# EAGLE design USB Client DP (EAGLE 5.04)
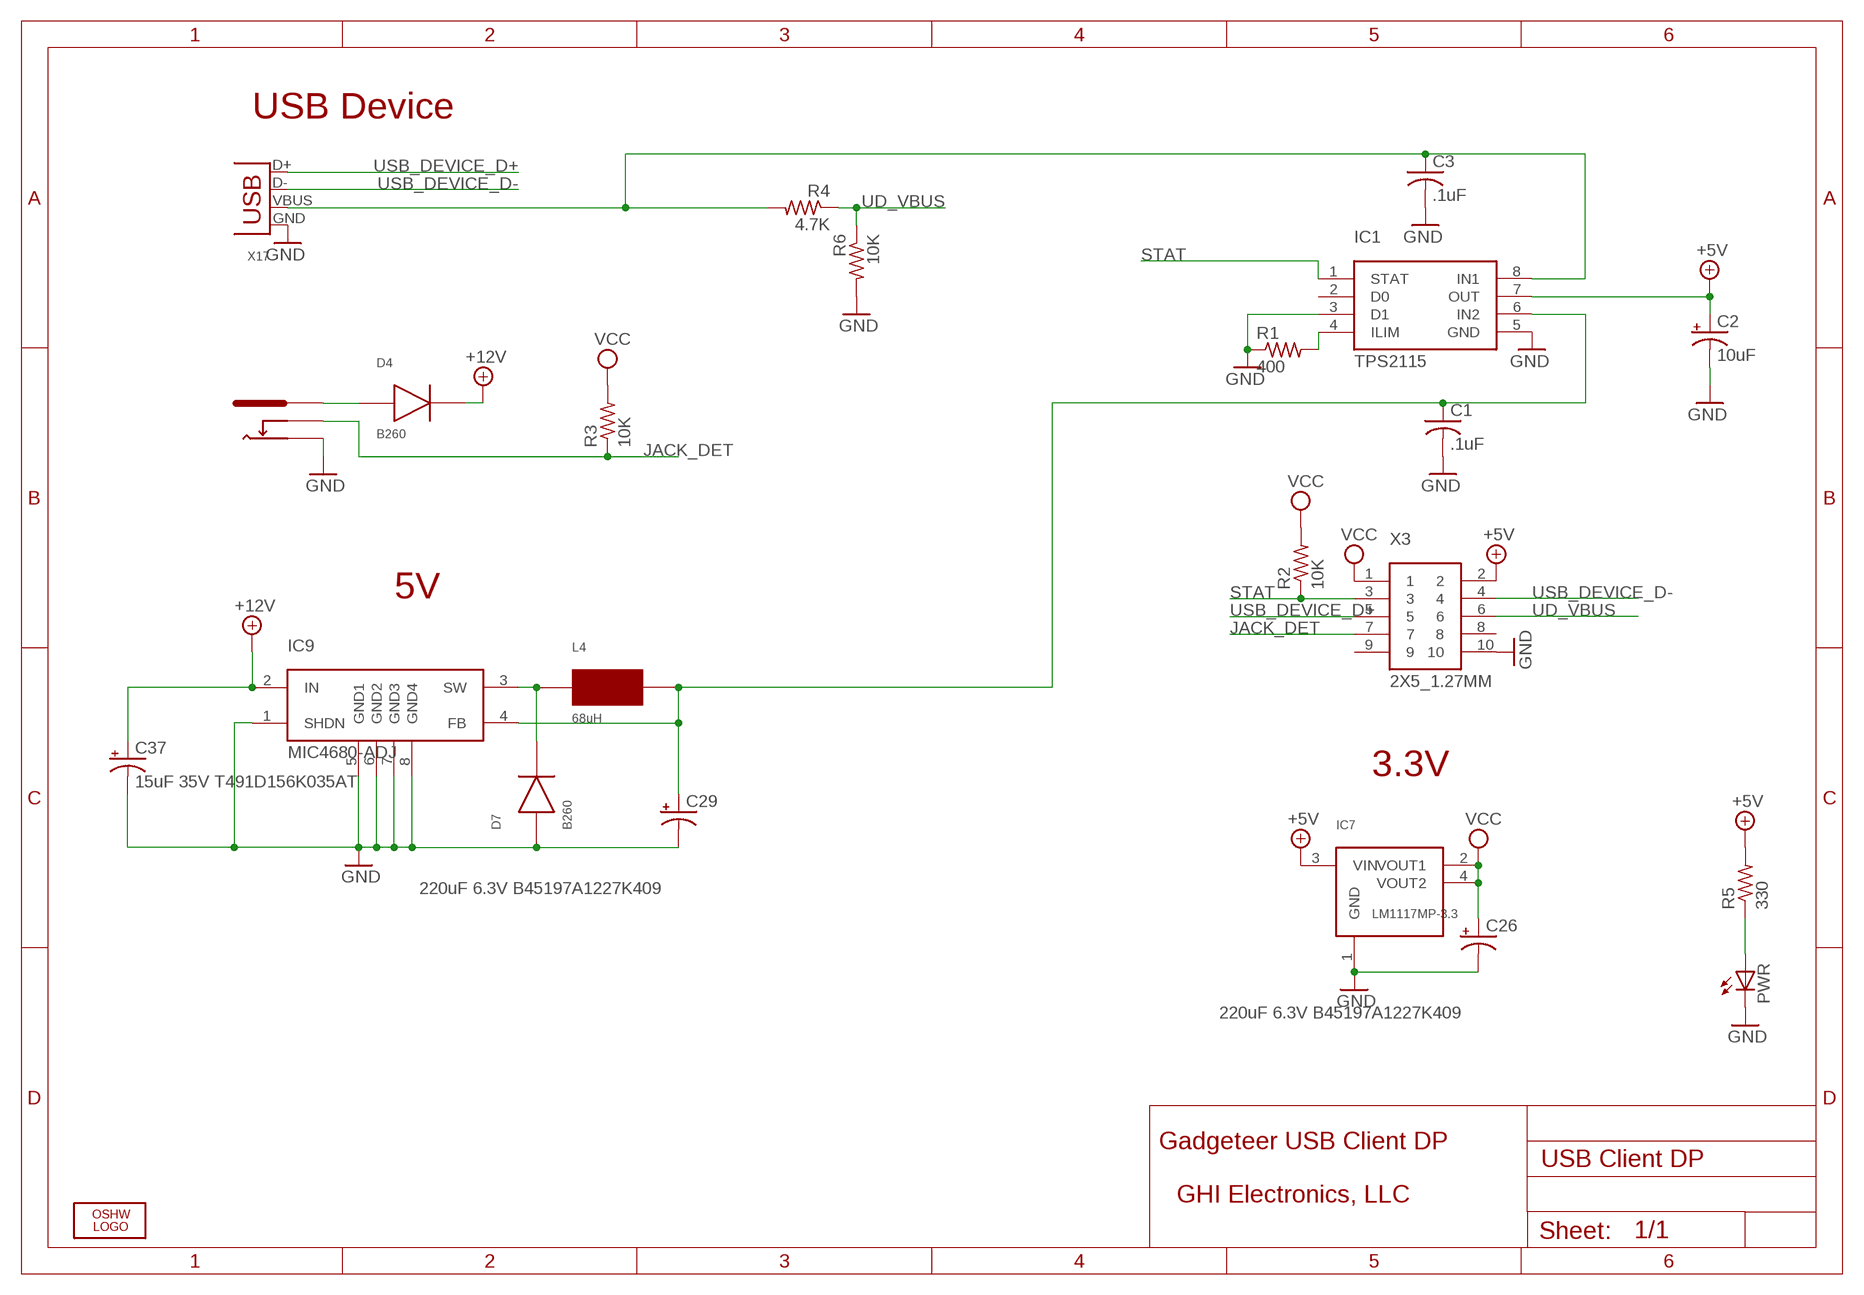
[diagram p0: schematic, sheet 1]

## Parts
C1  .1uF  C-USC0603K  [C0603K]
C2  10uF  CPOL-USCT3528  [CT3528]
C3  .1uF  C-USC0603K  [C0603K]
C26  220uF 6.3V B45197A1227K409  CPOL-USD/7343-31W  [D/7343-31W]
C29  220uF 6.3V B45197A1227K409  CPOL-USD/7343-31W  [D/7343-31W]
C37  15uF 35V T491D156K035AT  CPOL-USD/7343-31W  [D/7343-31W]
D4  B260  DIODE_SMA  [DIODE_SMA]
D7  B260  DIODE_SMA  [DIODE_SMA]
IC1  TPS2115  TSP2115  [TSSOP8]
IC7  LM1117MP-3.3  LM1117  [SOT223]
IC9  MIC4680-ADJ  MIC4680  [SO8]
L4  68uH  UP2BXXX  [UP2BXXX]
LOGO2  LOGO-OSHW-FILLX0200-NT  [OSHW_FILLX200_NOTEXT]
PWR  LEDCHIPLED_0805  [CHIPLED_0805]
R1  400  R-US_R0603  [R0603]
R2  10K  R-US_R0603  [R0603]
R3  10K  R-US_R0603  [R0603]
R4  4.7K  R-US_R0603  [R0603]
R5  330  R-US_R0603  [R0603]
R6  10K  R-US_R0603  [R0603]
X3  2X5_1.27MM  [2X5_1.27MM]
X11  PJ-102B_POWER_CON  [PJ-102B_POWER_CON]
X17  DX2R005HN2E700  USB-MB-S  [USB-MB-S]

## Nets
+5V [power]: C2.+ IC1.7(OUT) IC7.3(VIN) R5.2 X3.2
+12V: C37.+ D4.K IC9.2(IN)
GND [power]: C1.2 C2.- C3.2 C26.- C29.- C37.- D7.A IC1.3(D1) IC1.5(GND) IC7.1(GND) IC9.1(SHDN) IC9.5(GND1) IC9.6(GND2) IC9.7(GND3) IC9.8(GND4) PWR.C R1.1 R6.2 X3.10 X11.OUT X17.GND
JACK_DET: R3.1 X3.7 X11.OUT_CON
N$1: PWR.A R5.1
N$4: C1.1 C29.+ IC1.6(IN2) IC9.4(FB) L4.P$2
N$7: C3.1 IC1.8(IN1) R4.2 X17.VBUS
N$8: IC1.4(ILIM) R1.2
N$10: D7.K IC9.3(SW) L4.P$1
N$69: D4.A X11.IN
STAT: IC1.1(STAT) R2.1 X3.3
UD_VBUS: R4.1 R6.1 X3.6
USB_DEVICE_D+: X3.5 X17.D+
USB_DEVICE_D-: X3.4 X17.D-
VCC [power]: C26.+ IC7.2(VOUT1) IC7.4(VOUT2) R2.2 R3.2 X3.1
Unconnected: IC1.2(D0) X3.8 X3.9

## Notes on the sheet
- USB Device
- 5V
- 3.3V
- Gadgeteer USB Client DP
- GHI Electronics, LLC

## Library data of the parts
C1 C3 = rcl:C-US: CAPACITOR, American symbol
C2 C26 C29 C37 = rcl:CPOL-US: POLARIZED CAPACITOR, American symbol
D4 D7 = GHI:DIODE_SMA
IC1 = GHI:TSP2115
IC7 = GHI:LM1117
IC9 = GHI:MIC4680
L4 = GHI:UP2BXXX
LOGO2 = Logo:LOGO-OSHW-FILL
PWR = led:LED: LED OSRAM: - CHIPLED LG R971, LG N971, LY N971, LG Q971, LY Q971, LO R971, LY R971 LH N974, LH R974 LS Q976, LO Q976, LY Q976 LO Q996 - Hyper CHIPLED LW Q18S LB Q993, LB Q99A, LB R99A - SideLED LS A670, LO A670, LY A670, LG A670, LP A670 LB A673, LV A673, LT A673, LW A673 LH A674 LY A675 LS A676, LA A676, LO A676, LY A676, LW A676 LS A679, LY A679, LG A679 - Hyper Micro SIDELED® LS Y876, LA Y876, LO Y876, LY Y876 LT Y87S - SmartLED LW L88C, LW L88S LB L89C, LB L89S, LG L890 LS L89K, LO L89K, LY L89K LS L896, LA L896, LO L896, LY L896 - TOPLED LS T670, LO T670, LY T670, LG T670, LP T670 LSG T670, LSP T670, LSY T670, LOP T670, LYG T670 LG T671, LOG T671, LSG T671 LB T673, LV T673, LT T673, LW T673 LH T674 LS T676, LA T676, LO T676, LY T676, LB T676, LH T676, LSB T676, LW T676 LB T67C, LV T67C, LT T67C, LS T67K, LO T67K, LY T67K, LW E67C LS E67B, LA E67B, LO E67B, LY E67B, LB E67C, LV E67C, LT E67C LW T67C LS T679, LY T679, LG T679 LS T770, LO T770, LY T770, LG T770, LP T770 LB T773, LV T773, LT T773, LW T773 LH T774 LS E675, LA E675, LY E675, LS T675 LS T776, LA T776, LO T776, LY T776, LB T776 LHGB T686 LT T68C, LB T68C - Hyper Mini TOPLED® LB M676 - Mini TOPLED Santana® LG M470 LS M47K, LO M47K, LY M47K Source: http://www.osram.convergy.de LUXEON: - LUMILED® LXK2-PW12-R00, LXK2-PW12-S00, LXK2-PW14-U00, LXK2-PW14-V00 LXK2-PM12-R00, LXK2-PM12-S00, LXK2-PM14-U00 LXK2-PE12-Q00, LXK2-PE12-R00, LXK2-PE12-S00, LXK2-PE14-T00, LXK2-PE14-U00 LXK2-PB12-K00, LXK2-PB12-L00, LXK2-PB12-M00, LXK2-PB14-N00, LXK2-PB14-P00, LXK2-PB14-Q00 LXK2-PR12-L00, LXK2-PR12-M00, LXK2-PR14-Q00, LXK2-PR14-R00 LXK2-PD12-Q00, LXK2-PD12-R00, LXK2-PD12-S00 LXK2-PH12-R00, LXK2-PH12-S00 LXK2-PL12-P00, LXK2-PL12-Q00, LXK2-PL12-R00 Source: www.luxeon.com KINGBRIGHT: KA-3528ASYC Source: www.kingbright.com
R1-R6 = rcl:R-US_: RESISTOR, American symbol
X3 = GHI:2X5_1.27MM
X11 = GHI:PJ-102B_POWER_CON
X17 = con-usb-3:USB: USB Connectors

## Net classes
0 default: width 0.254 mm, drill 0.381 mm, clearance 0.203 mm

## Board
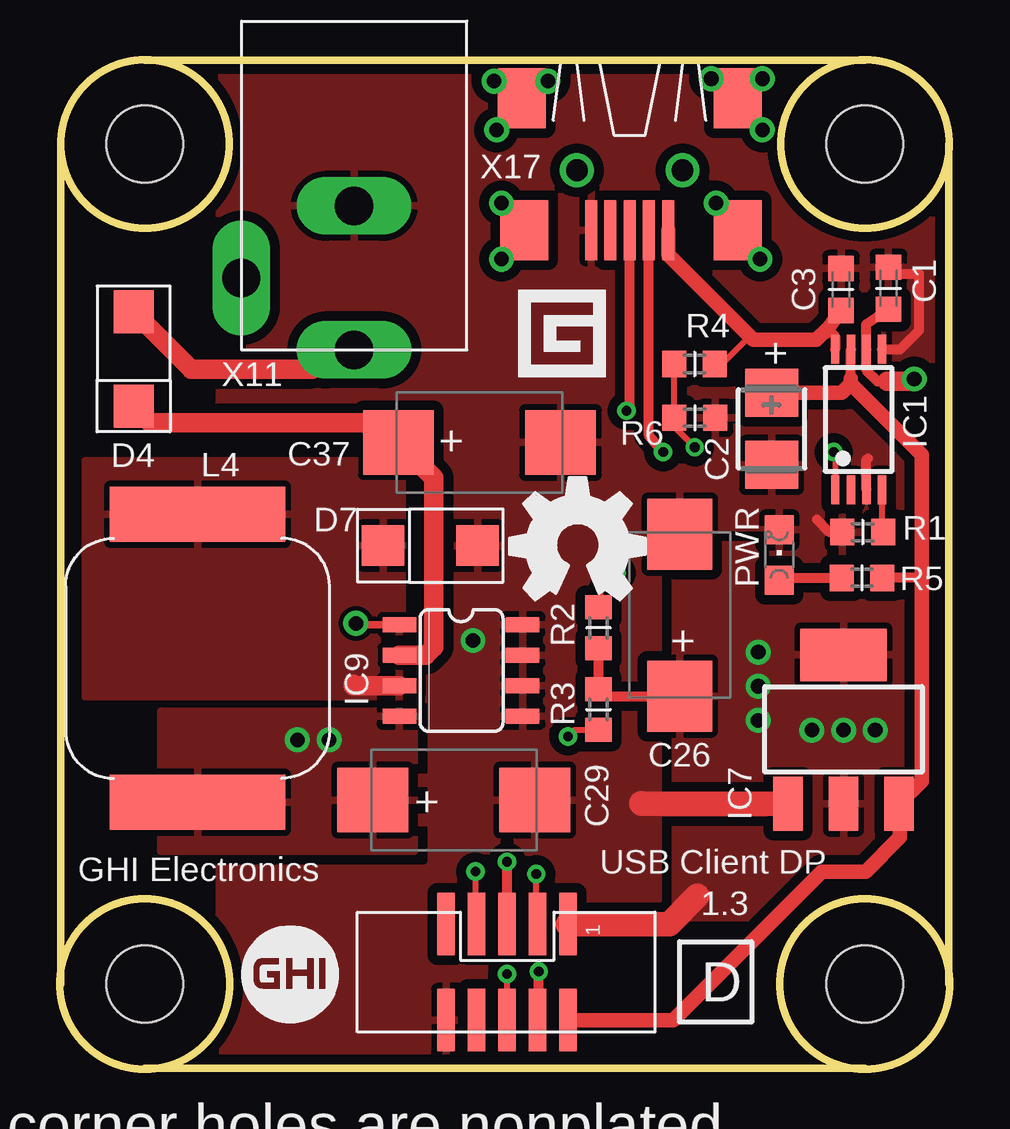
[diagram p1: board, top side]
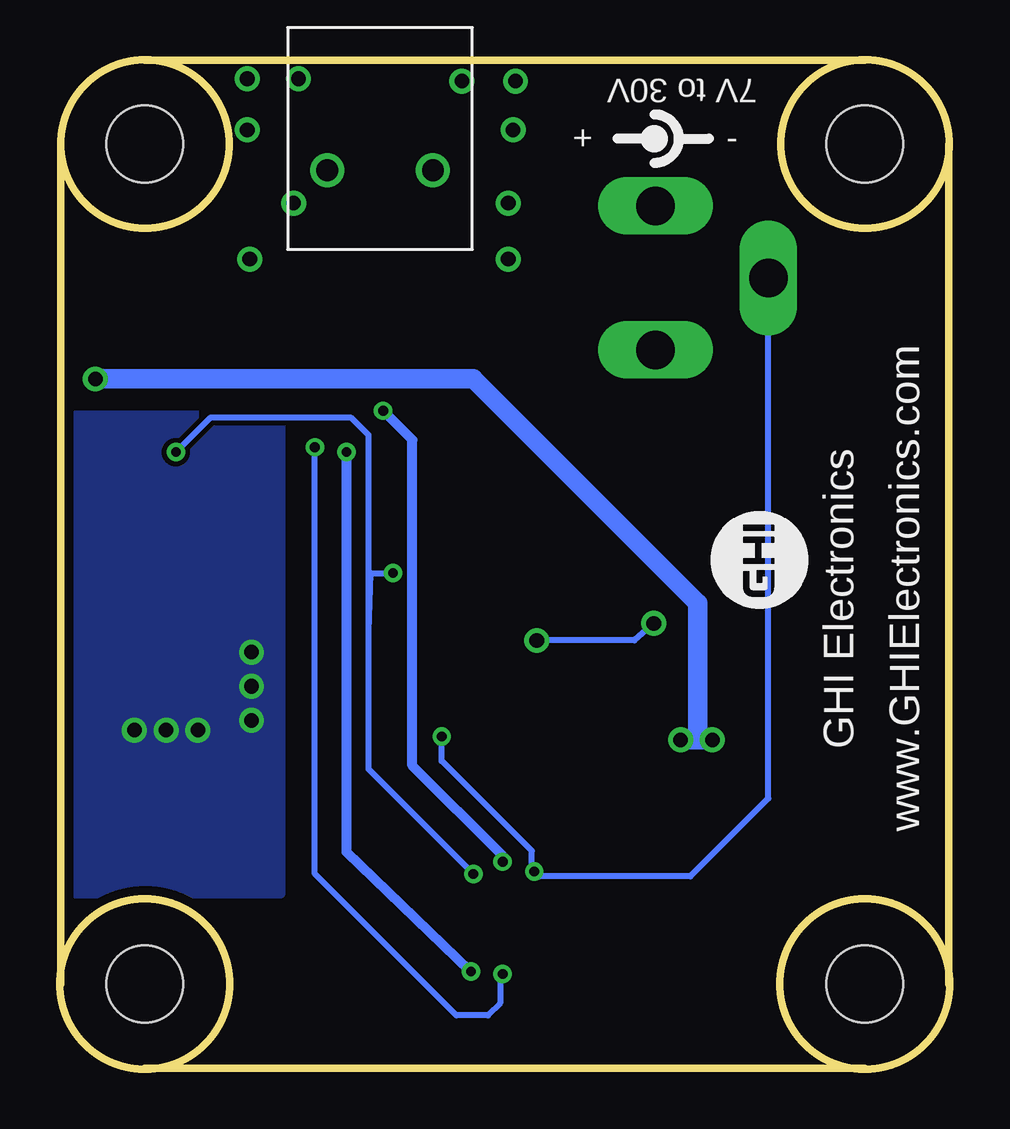
[diagram p2: board, bottom side, seen from below]

Size 37.07 x 42.04 mm. Coordinates in mm from the lower left corner, seen from the top.
Outline: 37.04,3.54 37.04,38.54
Outline: 0.04,38.54 0.04,3.54
Outline: 3.54,42.04 33.54,42.04
Outline: 33.54,0.04 3.54,0.04
Outline: circle at 3.54,38.54 radius 3.5
Outline: circle at 33.54,38.54 radius 3.5
Outline: circle at 33.54,3.54 radius 3.54
Outline: circle at 3.54,3.54 radius 3.54
Copper layers (1+16): Top 0.035mm / dielectric 1.5mm / Bottom 0.035mm
Design rules "default *": minimum track width 8mil, minimum drill 12mil, track to track 8mil, track to pad 8mil, pad to pad 8mil, via to via 8mil, smd to smd 8mil, copper to edge 15mil, drill to drill 8mil, minimum pad ring 10mil, minimum via ring 7mil, stop-mask expansion 4mil, vias tented up to drill 50mil, thermal gap 10mil
Holes 3.2 mm at 3.54,3.54 33.54,38.54 3.54,38.54 33.54,3.54

### Footprints (pad centres in the part's own frame; a part is rotated, then mirrored left to right if it is on the bottom)
C0603K = smd 1.05 x 1.08: 1 -0.875,0; 2 0.875,0
CT3528 = smd 2 x 2.2: + 1.5,0; - -1.5,0
D/7343-31W = smd 2.95 x 2.7: + 3.375,0; - -3.375,0
DIODE_SMA = smd 1.778 x 1.676: A -1.905,0; K 2.032,0
TSSOP8 = smd 0.35 x 1.2: 1 -0.975,-2.925; 2 -0.325,-2.925; 3 0.325,-2.925; 4 0.975,-2.925; 5 0.975,2.925; 6 0.325,2.925; 7 -0.325,2.925; 8 -0.975,2.925
SOT223 = smd 1.219 x 2.235: 1 -2.311,-3.099; 2 0,-3.099; 3 2.311,-3.099 | smd 3.6 x 2.2: 4 0,3.099
SO8 = smd 0.635 x 1.397: 1 -1.905,-2.565; 2 -0.635,-2.565; 3 0.635,-2.565; 4 1.905,-2.565; 5 1.905,2.565; 6 0.635,2.565; 7 -0.635,2.565; 8 -1.905,2.565
UP2BXXX = smd 2.3 x 7.3: P$1 -6,0; P$2 6,0
CHIPLED_0805 = smd 1.2 x 1.2: A 0,-1.05; C 0,1.05
R0603 = smd 1 x 1.1: 1 -0.85,0; 2 0.85,0
2X5_1.27MM = smd 2.6 x 0.74: 1 -2,2.58; 2 2,2.58; 3 -2,1.31; 4 2,1.31; 5 -2,0.04; 6 2,0.04; 7 -2,-1.23; 8 2,-1.23; 9 -2,-2.5; 10 2,-2.5
PJ-102B_POWER_CON = drill 1.6 long: IN -6,0; OUT 0,0; OUT_CON -3,4.7
USB-MB-S = smd 2.5 x 0.5: D+ 2.5,0; D- 2.5,0.8; GND 2.5,-1.6; ID 2.5,-0.8; VBUS 2.5,1.6 | smd 2.5 x 2: P$1 -3,-4.5; P$2 -3,4.5; P$3 2.5,-4.4; P$4 2.5,4.5 | drill 0.9 round: P$5 0,2.2; P$6 0,-2.2

### Placement (x,y rotation side)
C1  34.52,32.52 90 top
C2  29.65,26.67 90 top
C3  32.54,32.48 90 top
C26  25.83,18.9 270 top
C29  16.41,11.2 180 top
C37  17.48,26.1 180 top
D4  3.07,29.64 270 top
D7  15.5,21.8 180 top
IC1  33.28,27.06 0 top
IC7  32.65,14.15 0 top
IC9  16.71,16.6 270 top
L4  5.73,17.11 270 top
LOGO2  18.73,19.54 0 top
PWR  29.97,21.41 0 top
R1  33.44,22.37 0 top
R2  22.44,18.37 270 top
R3  22.44,14.97 90 top
R4  26.44,29.37 0 top
R5  33.42,20.46 0 top
R6  26.45,27.13 0 top
X3  18.59,4.03 270 top
X11  12.25,35.95 90 top
X17  23.74,37.44 270 top

### Tracks (layer width: path | path; a pad name or v marks a point on that pad's centre or on a via)
+5V
  Top 0.406: IC1.7 32.95,28.75 | R5.2 35.75,20.46 35.9,20.31
  Top 0.61: X3.2 25.54,2.03 31.73,8.22 33.56,8.22 34.99,9.64 34.99,11.02 IC7.3 35.9,11.99 35.9,20.31 35.9,25.6 32.95,28.54 | 32.95,28.54 32.95,28.75 | C2.+ 32.58,28.17 32.95,28.54
+12V
  Top 0.813: IC9.2 15.25,17.23 15.58,17.57 15.58,24.63 C37.+ 13.55,26.1 12.74,26.92 3.76,26.92 D4.K
GND  (via drill 0.61)
  Top 0.305: IC9.1 12.49,18.5 v12.33,18.56
  Top 0.406: IC1.5 35,29.98 35.8,30.78 35.8,33.11 34.81,33.11 C1.2 | IC1.3 33.6,25.37 33.67,25.44 | R1.1 32.06,22.37 31.53,22.9
  Top 1.016: IC7.1 24.24,11.05 24.22,11.07
  Bottom 0.254: v17.21,17.85 13.14,17.85 v12.33,18.56
  pour Top (isolate 0.406, rank 3): 6.64,42.61 6.64,0.27 36.51,0.27 36.51,42.61
JACK_DET  (via drill 0.41)
  Top 0.254: v17.31,8.22 17.31,6.08 X3.7 | R3.1 21.44,14.12 v21.17,13.85
  Bottom 0.254: X11.OUT_CON 7.55,11.27 10.81,8.02 17.1,8.02 v17.31,8.22 17.41,8.32 17.41,9.08 21.17,12.84 v21.17,13.85
N$1
  Top 0.406: R5.1 30.07,20.46 PWR.A
N$4  (via drill 0.61)
  Top 0.406: C1.1 33.6,31.03 IC1.6 33.6,29.11 34.07,28.64 34.48,28.64
  Top 0.813: C29.+ 13.64,10.31 | 34.48,28.64 35.49,28.64 v35.6,28.75
  Bottom 0.813: v9.89,13.71 10.5,13.71 | 10.5,13.71 v11.21,13.71 | 10.5,13.71 10.5,19.4 19.85,28.75 34.27,28.75 v35.6,28.75
  pour Top: 4.2,14.9 14.77,14.9 14.77,9.07 4.2,9.07
N$5  (via drill 0.61)
  other vias: 18.09,41.15
N$6  (via drill 0.61)
  other vias: 18.19,39.12
N$7
  Top 0.254: R4.2 27.58,29.37 28.74,30.52
  Top 0.406: IC1.8 32.3,30.52 31.98,30.84
  Top 0.61: X17.VBUS 25.34,33.93 28.74,30.52 28.89,30.37 31.52,30.37 31.98,30.84 C3.1
N$8
  Top 0.254: IC1.4 34.25,22.06 R1.2
N$10
  Top 0.813: IC9.3 12.23,15.96 12.23,16.02
  pour Top: 1.05,25.33 14.26,25.33 14.26,15.51 1.05,15.51
N$11  (via drill 0.61)
  other vias: 29.27,41.26
N$12  (via drill 0.61)
  other vias: 29.27,39.12
N$14  (via drill 0.61)
  other vias: 27.13,41.26
N$16  (via drill 0.61)
  other vias: 20.33,41.15
N$18  (via drill 0.61)
  other vias: 18.4,36.07
N$19  (via drill 0.61)
  other vias: 18.4,33.74
N$20  (via drill 0.61)
  other vias: 29.17,33.74
N$21  (via drill 0.61)
  other vias: 27.34,36.07
N$69
  Top 0.813: X11.IN 11.3,29.95 10.5,29.15 5.46,29.15 D4.A
STAT  (via drill 0.41)
  Top 0.254: IC1.1 32.3,25.64 v32.24,25.7 | v19.85,8.12 19.85,6.08 X3.3 | R2.1 22.54,20 v23.2,20.66
  Bottom 0.254: v32.24,25.7 30.82,27.12 24.93,27.12 24.22,26.41 24.22,18.22 | 24.22,18.22 24.22,12.49 v19.85,8.12 | v23.2,20.66 24.11,20.66 24.22,18.22
UD_VBUS  (via drill 0.41)
  Top 0.254: R4.1 25.59,27.14 R6.1 25.6,26.75 v26.45,25.9 | v18.63,3.95 X3.6
  Bottom 0.254: v26.45,25.9 26.45,8.12 20.56,2.23 19.24,2.23 18.73,2.74 18.73,3.85 v18.63,3.95
USB_DEVICE_D+  (via drill 0.41)
  Top 0.406: X17.D+ 23.74,27.55 v23.61,27.42 | v18.63,8.63 X3.5
  Bottom 0.406: v18.63,8.63 18.63,8.87 22.39,12.63 22.39,26.21 v23.61,27.42
USB_DEVICE_D-  (via drill 0.41)
  Top 0.406: X17.D- 24.54,26.39 v25.13,25.7 | v19.95,4.06 19.95,2.08 X3.4
  Bottom 0.406: v25.13,25.7 25.13,9.03 v19.95,4.06
VCC  (via drill 0.61)
  Top 0.406: C26.+ 22.44,15.53 R3.2 22.44,15.99 R2.2
  Top 1.016: X3.1 25.38,6.03 26.55,7.21
  other vias: 31.33,14.11 33.97,14.11 32.65,14.11 29.09,14.52 29.09,15.94 29.09,17.37
  pour Top (isolate 0.406): 25.64,21.84 25.64,6.29 36,6.29 36,21.84
  pour Bottom (rank 3): 27.87,27.22 36.41,27.22 36.41,7.31 27.87,7.31

### Text on the board
tPlace: + | + | + | + | GHI Electronics | USB Client DP | 1.3 | D | corner holes are nonplated | red PCB with white text | do not add manufacturing codes
bPlace: 7V to 30V | - | + | GHI Electronics | www.GHIElectronics.com
201bmp: C:/Users/Gus Issa/Desktop/GHILogo_BW.bmp